# EAGLE design breadboard-long-with-header (EAGLE 7.1.0)
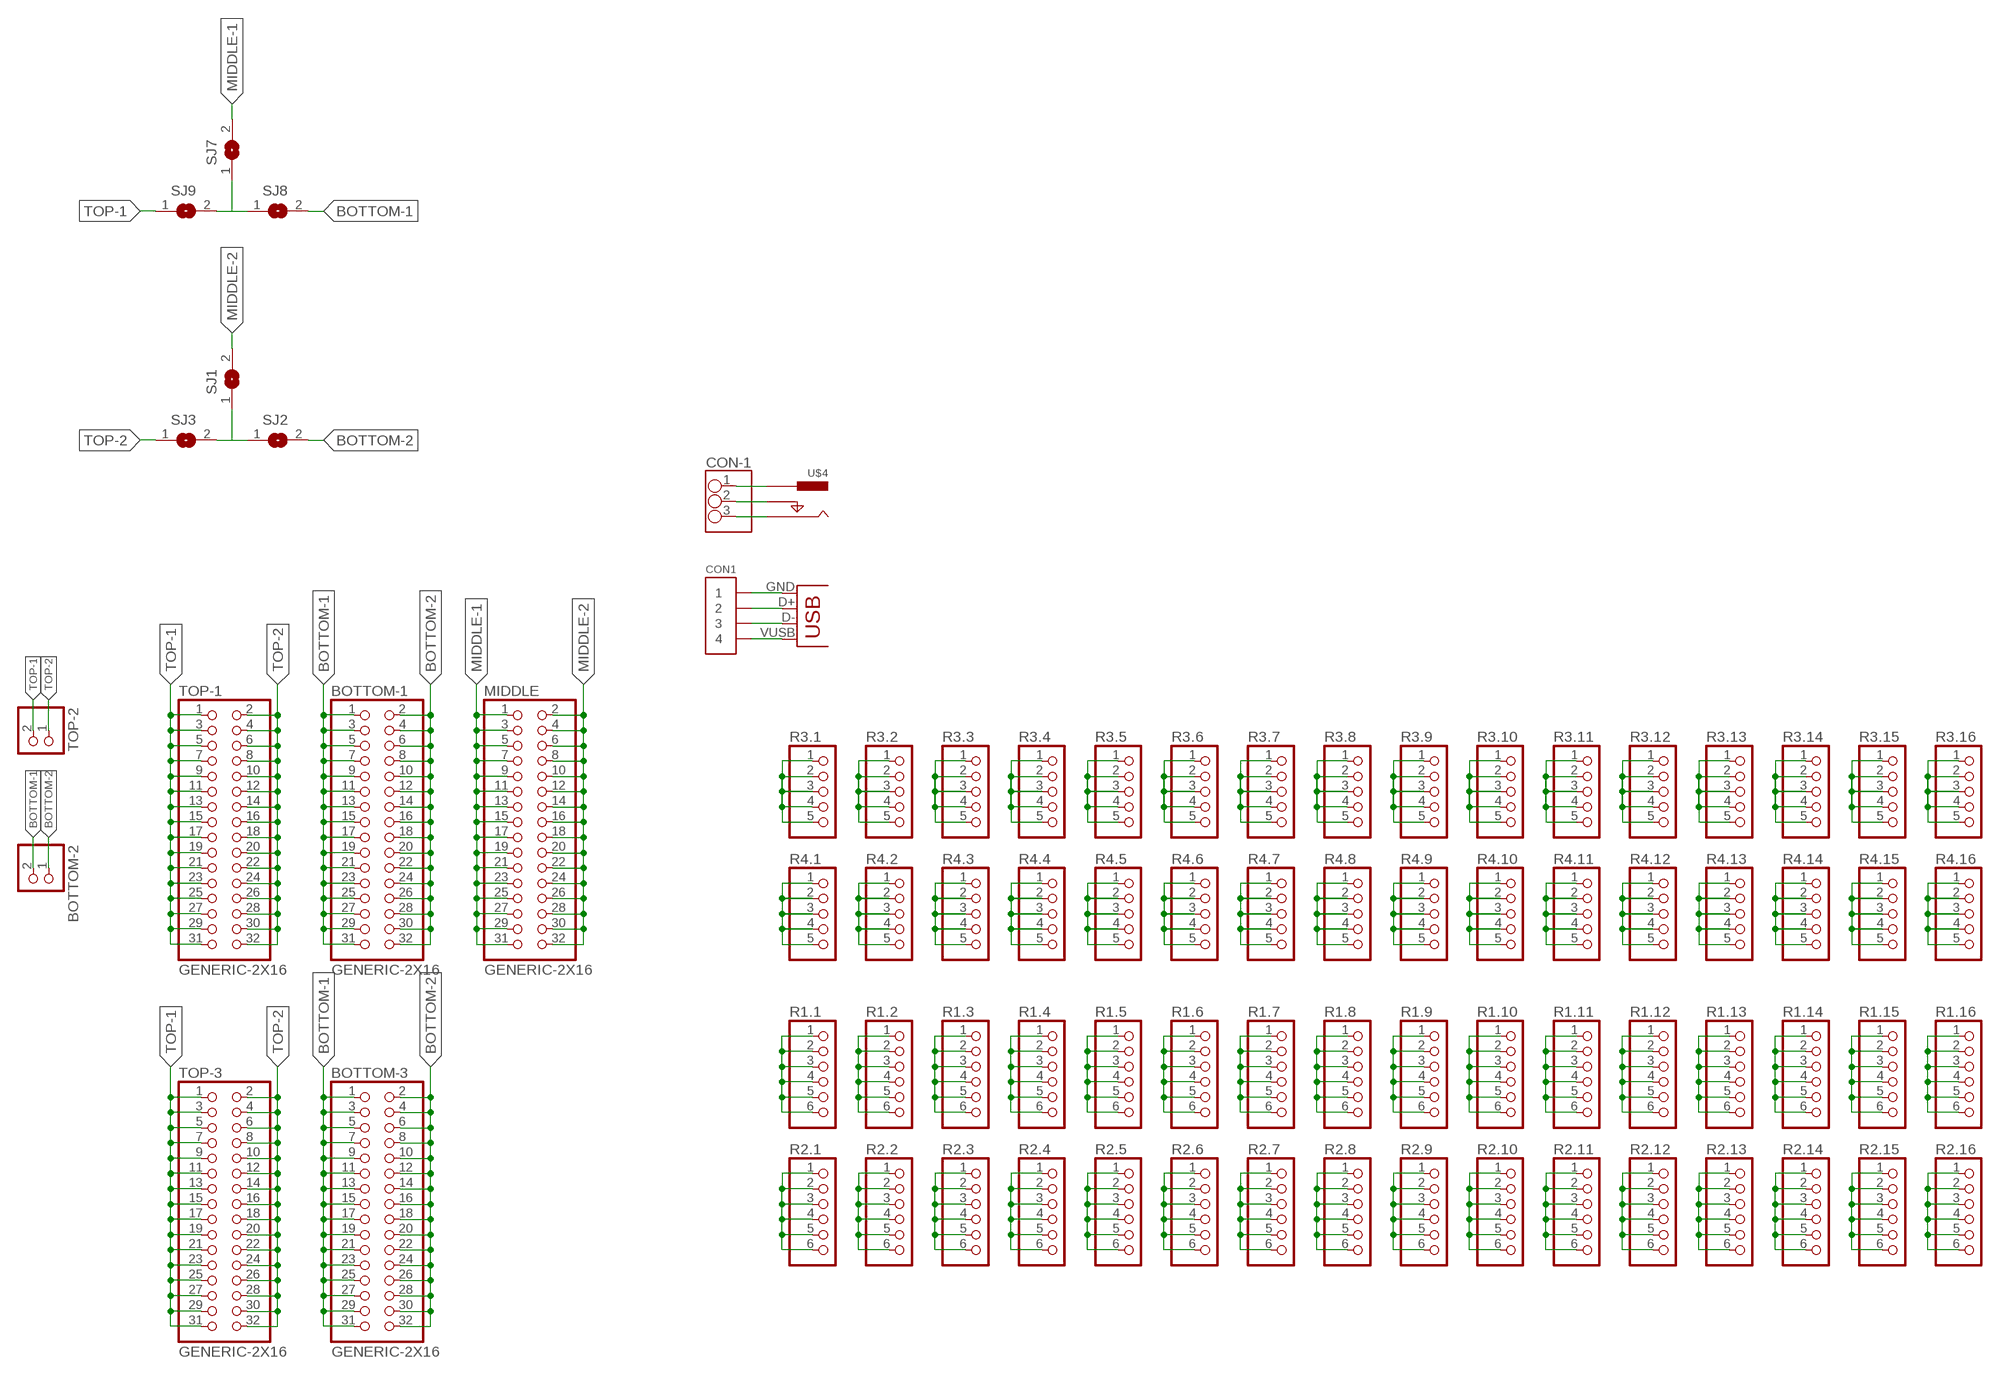
[diagram p0: schematic, sheet 1]

## Parts
BOTTOM-1  GENERIC-2X16  [PINHEADER-100MIL-2X16-NOSILK]
BOTTOM-2  GENERIC-1X2  [PINHEADER-100MIL-1X2-NOSILK]
BOTTOM-3  GENERIC-2X16  [PINHEADER-100MIL-2X16-NOSILK]
CON1  GENERIC-1X4STRAIGHT  [PINHEADER-100MIL-1X4-NOSILK]
CON-1  GENERIC-1X3  [PINHEADER-100MIL-1X3-NOSILK]
MIDDLE  GENERIC-2X16  [PINHEADER-100MIL-2X16-NOSILK]
R1.1  GENERIC-1X6  [PINHEADER-100MIL-1X6-NOSILK]
R1.2  GENERIC-1X6  [PINHEADER-100MIL-1X6-NOSILK]
R1.3  GENERIC-1X6  [PINHEADER-100MIL-1X6-NOSILK]
R1.4  GENERIC-1X6  [PINHEADER-100MIL-1X6-NOSILK]
R1.5  GENERIC-1X6  [PINHEADER-100MIL-1X6-NOSILK]
R1.6  GENERIC-1X6  [PINHEADER-100MIL-1X6-NOSILK]
R1.7  GENERIC-1X6  [PINHEADER-100MIL-1X6-NOSILK]
R1.8  GENERIC-1X6  [PINHEADER-100MIL-1X6-NOSILK]
R1.9  GENERIC-1X6  [PINHEADER-100MIL-1X6-NOSILK]
R1.10  GENERIC-1X6  [PINHEADER-100MIL-1X6-NOSILK]
R1.11  GENERIC-1X6  [PINHEADER-100MIL-1X6-NOSILK]
R1.12  GENERIC-1X6  [PINHEADER-100MIL-1X6-NOSILK]
R1.13  GENERIC-1X6  [PINHEADER-100MIL-1X6-NOSILK]
R1.14  GENERIC-1X6  [PINHEADER-100MIL-1X6-NOSILK]
R1.15  GENERIC-1X6  [PINHEADER-100MIL-1X6-NOSILK]
R1.16  GENERIC-1X6  [PINHEADER-100MIL-1X6-NOSILK]
R2.1  GENERIC-1X6  [PINHEADER-100MIL-1X6-NOSILK]
R2.2  GENERIC-1X6  [PINHEADER-100MIL-1X6-NOSILK]
R2.3  GENERIC-1X6  [PINHEADER-100MIL-1X6-NOSILK]
R2.4  GENERIC-1X6  [PINHEADER-100MIL-1X6-NOSILK]
R2.5  GENERIC-1X6  [PINHEADER-100MIL-1X6-NOSILK]
R2.6  GENERIC-1X6  [PINHEADER-100MIL-1X6-NOSILK]
R2.7  GENERIC-1X6  [PINHEADER-100MIL-1X6-NOSILK]
R2.8  GENERIC-1X6  [PINHEADER-100MIL-1X6-NOSILK]
R2.9  GENERIC-1X6  [PINHEADER-100MIL-1X6-NOSILK]
R2.10  GENERIC-1X6  [PINHEADER-100MIL-1X6-NOSILK]
R2.11  GENERIC-1X6  [PINHEADER-100MIL-1X6-NOSILK]
R2.12  GENERIC-1X6  [PINHEADER-100MIL-1X6-NOSILK]
R2.13  GENERIC-1X6  [PINHEADER-100MIL-1X6-NOSILK]
R2.14  GENERIC-1X6  [PINHEADER-100MIL-1X6-NOSILK]
R2.15  GENERIC-1X6  [PINHEADER-100MIL-1X6-NOSILK]
R2.16  GENERIC-1X6  [PINHEADER-100MIL-1X6-NOSILK]
R3.1  GENERIC-1X5  [PINHEADER-100MIL-1X5-NOSILK]
R3.2  GENERIC-1X5  [PINHEADER-100MIL-1X5-NOSILK]
R3.3  GENERIC-1X5  [PINHEADER-100MIL-1X5-NOSILK]
R3.4  GENERIC-1X5  [PINHEADER-100MIL-1X5-NOSILK]
R3.5  GENERIC-1X5  [PINHEADER-100MIL-1X5-NOSILK]
R3.6  GENERIC-1X5  [PINHEADER-100MIL-1X5-NOSILK]
R3.7  GENERIC-1X5  [PINHEADER-100MIL-1X5-NOSILK]
R3.8  GENERIC-1X5  [PINHEADER-100MIL-1X5-NOSILK]
R3.9  GENERIC-1X5  [PINHEADER-100MIL-1X5-NOSILK]
R3.10  GENERIC-1X5  [PINHEADER-100MIL-1X5-NOSILK]
R3.11  GENERIC-1X5  [PINHEADER-100MIL-1X5-NOSILK]
R3.12  GENERIC-1X5  [PINHEADER-100MIL-1X5-NOSILK]
R3.13  GENERIC-1X5  [PINHEADER-100MIL-1X5-NOSILK]
R3.14  GENERIC-1X5  [PINHEADER-100MIL-1X5-NOSILK]
R3.15  GENERIC-1X5  [PINHEADER-100MIL-1X5-NOSILK]
R3.16  GENERIC-1X5  [PINHEADER-100MIL-1X5-NOSILK]
R4.1  GENERIC-1X5  [PINHEADER-100MIL-1X5-NOSILK]
R4.2  GENERIC-1X5  [PINHEADER-100MIL-1X5-NOSILK]
R4.3  GENERIC-1X5  [PINHEADER-100MIL-1X5-NOSILK]
R4.4  GENERIC-1X5  [PINHEADER-100MIL-1X5-NOSILK]
R4.5  GENERIC-1X5  [PINHEADER-100MIL-1X5-NOSILK]
R4.6  GENERIC-1X5  [PINHEADER-100MIL-1X5-NOSILK]
R4.7  GENERIC-1X5  [PINHEADER-100MIL-1X5-NOSILK]
R4.8  GENERIC-1X5  [PINHEADER-100MIL-1X5-NOSILK]
R4.9  GENERIC-1X5  [PINHEADER-100MIL-1X5-NOSILK]
R4.10  GENERIC-1X5  [PINHEADER-100MIL-1X5-NOSILK]
R4.11  GENERIC-1X5  [PINHEADER-100MIL-1X5-NOSILK]
R4.12  GENERIC-1X5  [PINHEADER-100MIL-1X5-NOSILK]
R4.13  GENERIC-1X5  [PINHEADER-100MIL-1X5-NOSILK]
R4.14  GENERIC-1X5  [PINHEADER-100MIL-1X5-NOSILK]
R4.15  GENERIC-1X5  [PINHEADER-100MIL-1X5-NOSILK]
R4.16  GENERIC-1X5  [PINHEADER-100MIL-1X5-NOSILK]
SJ1  SJ  [SJ]
SJ2  SJ  [SJ]
SJ3  SJ  [SJ]
SJ7  SJ  [SJ]
SJ8  SJ  [SJ]
SJ9  SJ  [SJ]
TOP-1  GENERIC-2X16  [PINHEADER-100MIL-2X16-NOSILK]
TOP-2  GENERIC-1X2  [PINHEADER-100MIL-1X2-NOSILK]
TOP-3  GENERIC-2X16  [PINHEADER-100MIL-2X16-NOSILK]
U$3  USBMINI-HAND  [USB-MINI-B-HAND_EXTRA_LONG]
U$4  POWER-BARREL_JACKEBAY  [POWER-BARREL-2MM1-EBAY]

## Nets
BOTTOM-1: BOTTOM-1.1 BOTTOM-1.3 BOTTOM-1.5 BOTTOM-1.7 BOTTOM-1.9 BOTTOM-1.11 BOTTOM-1.13 BOTTOM-1.15 BOTTOM-1.17 BOTTOM-1.19 BOTTOM-1.21 BOTTOM-1.23 BOTTOM-1.25 BOTTOM-1.27 BOTTOM-1.29 BOTTOM-1.31 BOTTOM-2.2 BOTTOM-3.1 BOTTOM-3.3 BOTTOM-3.5 BOTTOM-3.7 BOTTOM-3.9 BOTTOM-3.11 BOTTOM-3.13 BOTTOM-3.15 BOTTOM-3.17 BOTTOM-3.19 BOTTOM-3.21 BOTTOM-3.23 BOTTOM-3.25 BOTTOM-3.27 BOTTOM-3.29 BOTTOM-3.31 SJ8.2
BOTTOM-2: BOTTOM-1.2 BOTTOM-1.4 BOTTOM-1.6 BOTTOM-1.8 BOTTOM-1.10 BOTTOM-1.12 BOTTOM-1.14 BOTTOM-1.16 BOTTOM-1.18 BOTTOM-1.20 BOTTOM-1.22 BOTTOM-1.24 BOTTOM-1.26 BOTTOM-1.28 BOTTOM-1.30 BOTTOM-1.32 BOTTOM-2.1 BOTTOM-3.2 BOTTOM-3.4 BOTTOM-3.6 BOTTOM-3.8 BOTTOM-3.10 BOTTOM-3.12 BOTTOM-3.14 BOTTOM-3.16 BOTTOM-3.18 BOTTOM-3.20 BOTTOM-3.22 BOTTOM-3.24 BOTTOM-3.26 BOTTOM-3.28 BOTTOM-3.30 BOTTOM-3.32 SJ2.2
CENTER: CON-1.1 U$4.P$4(CENTER)
MIDDLE-1: MIDDLE.1 MIDDLE.3 MIDDLE.5 MIDDLE.7 MIDDLE.9 MIDDLE.11 MIDDLE.13 MIDDLE.15 MIDDLE.17 MIDDLE.19 MIDDLE.21 MIDDLE.23 MIDDLE.25 MIDDLE.27 MIDDLE.29 MIDDLE.31 SJ7.2
MIDDLE-2: MIDDLE.2 MIDDLE.4 MIDDLE.6 MIDDLE.8 MIDDLE.10 MIDDLE.12 MIDDLE.14 MIDDLE.16 MIDDLE.18 MIDDLE.20 MIDDLE.22 MIDDLE.24 MIDDLE.26 MIDDLE.28 MIDDLE.30 MIDDLE.32 SJ1.2
N$1: R3.1.1 R3.1.2 R3.1.3 R3.1.4 R3.1.5
N$2: R4.1.1 R4.1.2 R4.1.3 R4.1.4 R4.1.5
N$3: R2.6.1 R2.6.2 R2.6.3 R2.6.4 R2.6.5 R2.6.6
N$4: R1.6.1 R1.6.2 R1.6.3 R1.6.4 R1.6.5 R1.6.6
N$5: R2.7.1 R2.7.2 R2.7.3 R2.7.4 R2.7.5 R2.7.6
N$6: R1.7.1 R1.7.2 R1.7.3 R1.7.4 R1.7.5 R1.7.6
N$7: R2.8.1 R2.8.2 R2.8.3 R2.8.4 R2.8.5 R2.8.6
N$8: R1.8.1 R1.8.2 R1.8.3 R1.8.4 R1.8.5 R1.8.6
N$9: R2.9.1 R2.9.2 R2.9.3 R2.9.4 R2.9.5 R2.9.6
N$10: R2.1.1 R2.1.2 R2.1.3 R2.1.4 R2.1.5 R2.1.6
N$11: R1.1.1 R1.1.2 R1.1.3 R1.1.4 R1.1.5 R1.1.6
N$12: R2.3.1 R2.3.2 R2.3.3 R2.3.4 R2.3.5 R2.3.6
N$13: R2.2.1 R2.2.2 R2.2.3 R2.2.4 R2.2.5 R2.2.6
N$14: R1.2.1 R1.2.2 R1.2.3 R1.2.4 R1.2.5 R1.2.6
N$15: R1.3.1 R1.3.2 R1.3.3 R1.3.4 R1.3.5 R1.3.6
N$16: R2.4.1 R2.4.2 R2.4.3 R2.4.4 R2.4.5 R2.4.6
N$17: R1.4.1 R1.4.2 R1.4.3 R1.4.4 R1.4.5 R1.4.6
N$18: R2.5.1 R2.5.2 R2.5.3 R2.5.4 R2.5.5 R2.5.6
N$19: R1.5.1 R1.5.2 R1.5.3 R1.5.4 R1.5.5 R1.5.6
N$20: R3.2.1 R3.2.2 R3.2.3 R3.2.4 R3.2.5
N$21: R4.2.1 R4.2.2 R4.2.3 R4.2.4 R4.2.5
N$22: R3.3.1 R3.3.2 R3.3.3 R3.3.4 R3.3.5
N$23: R4.3.1 R4.3.2 R4.3.3 R4.3.4 R4.3.5
N$24: R3.4.1 R3.4.2 R3.4.3 R3.4.4 R3.4.5
N$25: R4.4.1 R4.4.2 R4.4.3 R4.4.4 R4.4.5
N$26: R3.5.1 R3.5.2 R3.5.3 R3.5.4 R3.5.5
N$27: R4.5.1 R4.5.2 R4.5.3 R4.5.4 R4.5.5
N$28: R3.6.1 R3.6.2 R3.6.3 R3.6.4 R3.6.5
N$29: R4.6.1 R4.6.2 R4.6.3 R4.6.4 R4.6.5
N$30: R3.7.1 R3.7.2 R3.7.3 R3.7.4 R3.7.5
N$31: R4.7.1 R4.7.2 R4.7.3 R4.7.4 R4.7.5
N$32: R3.8.1 R3.8.2 R3.8.3 R3.8.4 R3.8.5
N$33: R4.8.1 R4.8.2 R4.8.3 R4.8.4 R4.8.5
N$34: R3.9.1 R3.9.2 R3.9.3 R3.9.4 R3.9.5
N$35: R4.9.1 R4.9.2 R4.9.3 R4.9.4 R4.9.5
N$36: SJ1.1 SJ2.1 SJ3.2
N$37: R1.9.1 R1.9.2 R1.9.3 R1.9.4 R1.9.5 R1.9.6
N$38: SJ7.1 SJ8.1 SJ9.2
N$39: R2.10.1 R2.10.2 R2.10.3 R2.10.4 R2.10.5 R2.10.6
N$40: R1.10.1 R1.10.2 R1.10.3 R1.10.4 R1.10.5 R1.10.6
N$41: R2.11.1 R2.11.2 R2.11.3 R2.11.4 R2.11.5 R2.11.6
N$42: R1.11.1 R1.11.2 R1.11.3 R1.11.4 R1.11.5 R1.11.6
N$43: R2.12.1 R2.12.2 R2.12.3 R2.12.4 R2.12.5 R2.12.6
N$44: R1.12.1 R1.12.2 R1.12.3 R1.12.4 R1.12.5 R1.12.6
N$45: R2.13.1 R2.13.2 R2.13.3 R2.13.4 R2.13.5 R2.13.6
N$46: R1.13.1 R1.13.2 R1.13.3 R1.13.4 R1.13.5 R1.13.6
N$47: R2.14.1 R2.14.2 R2.14.3 R2.14.4 R2.14.5 R2.14.6
N$48: R1.14.1 R1.14.2 R1.14.3 R1.14.4 R1.14.5 R1.14.6
N$49: R2.15.1 R2.15.2 R2.15.3 R2.15.4 R2.15.5 R2.15.6
N$50: R1.15.1 R1.15.2 R1.15.3 R1.15.4 R1.15.5 R1.15.6
N$51: R2.16.1 R2.16.2 R2.16.3 R2.16.4 R2.16.5 R2.16.6
N$52: R1.16.1 R1.16.2 R1.16.3 R1.16.4 R1.16.5 R1.16.6
N$53: R3.10.1 R3.10.2 R3.10.3 R3.10.4 R3.10.5
N$54: R4.10.1 R4.10.2 R4.10.3 R4.10.4 R4.10.5
N$55: R3.11.1 R3.11.2 R3.11.3 R3.11.4 R3.11.5
N$56: R4.11.1 R4.11.2 R4.11.3 R4.11.4 R4.11.5
N$57: R3.12.1 R3.12.2 R3.12.3 R3.12.4 R3.12.5
N$58: R4.12.1 R4.12.2 R4.12.3 R4.12.4 R4.12.5
N$59: R3.13.1 R3.13.2 R3.13.3 R3.13.4 R3.13.5
N$60: R4.13.1 R4.13.2 R4.13.3 R4.13.4 R4.13.5
N$61: R3.14.1 R3.14.2 R3.14.3 R3.14.4 R3.14.5
N$62: R4.14.1 R4.14.2 R4.14.3 R4.14.4 R4.14.5
N$63: R3.15.1 R3.15.2 R3.15.3 R3.15.4 R3.15.5
N$64: R4.15.1 R4.15.2 R4.15.3 R4.15.4 R4.15.5
N$65: R3.16.1 R3.16.2 R3.16.3 R3.16.4 R3.16.5
N$66: R4.16.1 R4.16.2 R4.16.3 R4.16.4 R4.16.5
SLEEVE: CON-1.3 U$4.P$3(OUTER)
SWITCH: CON-1.2 U$4.P$2(SWITCH)
TOP-1: SJ9.1 TOP-1.1 TOP-1.3 TOP-1.5 TOP-1.7 TOP-1.9 TOP-1.11 TOP-1.13 TOP-1.15 TOP-1.17 TOP-1.19 TOP-1.21 TOP-1.23 TOP-1.25 TOP-1.27 TOP-1.29 TOP-1.31 TOP-2.2 TOP-3.1 TOP-3.3 TOP-3.5 TOP-3.7 TOP-3.9 TOP-3.11 TOP-3.13 TOP-3.15 TOP-3.17 TOP-3.19 TOP-3.21 TOP-3.23 TOP-3.25 TOP-3.27 TOP-3.29 TOP-3.31
TOP-2: SJ3.1 TOP-1.2 TOP-1.4 TOP-1.6 TOP-1.8 TOP-1.10 TOP-1.12 TOP-1.14 TOP-1.16 TOP-1.18 TOP-1.20 TOP-1.22 TOP-1.24 TOP-1.26 TOP-1.28 TOP-1.30 TOP-1.32 TOP-2.1 TOP-3.2 TOP-3.4 TOP-3.6 TOP-3.8 TOP-3.10 TOP-3.12 TOP-3.14 TOP-3.16 TOP-3.18 TOP-3.20 TOP-3.22 TOP-3.24 TOP-3.26 TOP-3.28 TOP-3.30 TOP-3.32
USB-D+: CON1.2 U$3.D+
USB-DI: CON1.3 U$3.D-
USB-GND: CON1.1 U$3.GND
USB-V+: CON1.4 U$3.VUSB(VBUS)

## Library data of the parts
BOTTOM-1 BOTTOM-3 MIDDLE TOP-1 TOP-3 = p.peter-connectors:GENERIC-2X16
BOTTOM-2 TOP-2 = p.peter-connectors:GENERIC-1X2
CON1 = p.peter-connectors:GENERIC-1X4
CON-1 = p.peter-connectors:GENERIC-1X3
R1.1-R1.16 R2.1-R2.16 = p.peter-connectors:GENERIC-1X6
R3.1-R3.16 R4.1-R4.16 = p.peter-connectors:GENERIC-1X5
SJ1-SJ3 SJ7-SJ9 = jumper:SJ: SMD solder JUMPER
U$3 = p.peter-connectors:USB
U$4 = p.peter-connectors:POWER-BARREL_JACK

## Board
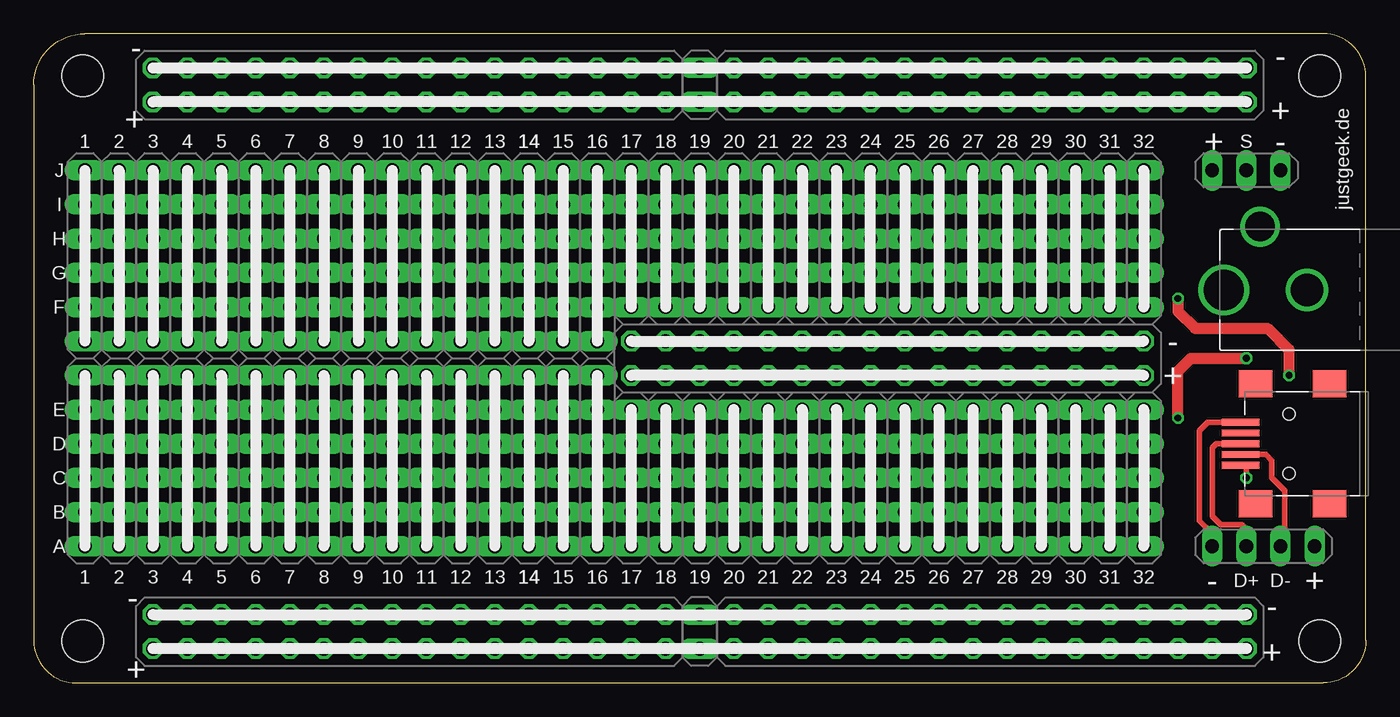
[diagram p1: board, top side]
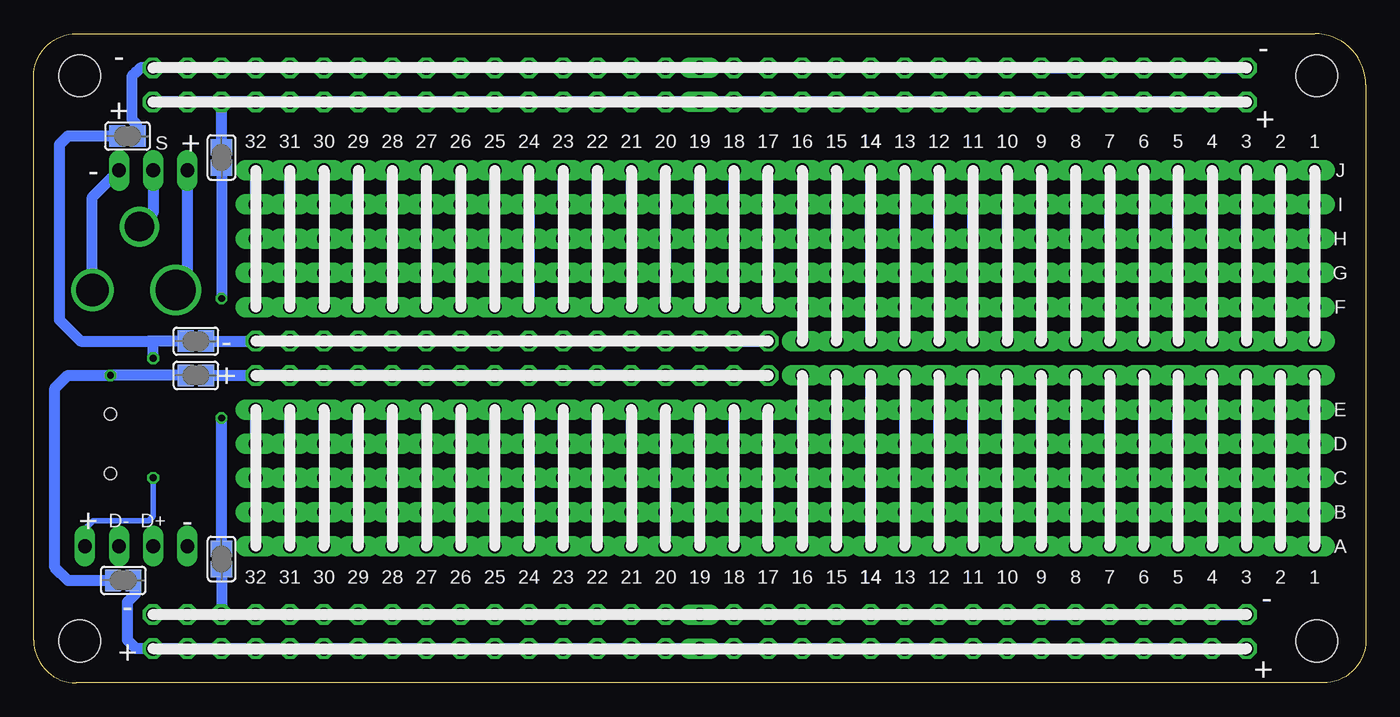
[diagram p2: board, bottom side, seen from below]

Size 99.06 x 48.26 mm. Coordinates in mm from the lower left corner, seen from the top.
Outline: 3.17,0 95.89,0 arc90 99.06,3.17 99.06,45.09 arc90 95.89,48.26 91.44,48.26 7.62,48.26 3.81,48.26 arc90 0,44.45 0,3.17 arc90 3.17,0
Copper layers (1*16): Top 0.0356mm / dielectric 1.5011mm / Bottom 0.0356mm
Design rules "breadboard": minimum track width 6mil, minimum drill 13mil, track to track 6mil, track to pad 6mil, pad to pad 6mil, via to via 6mil, smd to smd 6mil, copper to edge 15mil, drill to drill 6mil, minimum pad ring 8mil, minimum via ring 7mil, stop-mask expansion 4mil, vias tented up to drill 4.1mm, thermal gap 10mil
Holes 3.1 mm at 95.64,45.12 95.64,3.12 3.63,3.12 3.63,45.12

### Footprints (pad centres in the part's own frame; a part is rotated, then mirrored left to right if it is on the bottom)
PINHEADER-100MIL-2X16-NOSILK = drill 1.016 octagon: 1 -19.05,-1.27; 2 -19.05,1.27; 3 -16.51,-1.27; 4 -16.51,1.27; 5 -13.97,-1.27; 6 -13.97,1.27; 7 -11.43,-1.27; 8 -11.43,1.27; 9 -8.89,-1.27; 10 -8.89,1.27; 11 -6.35,-1.27; 12 -6.35,1.27; 13 -3.81,-1.27; 14 -3.81,1.27; 15 -1.27,-1.27; 16 -1.27,1.27; 17 1.27,-1.27; 18 1.27,1.27; 19 3.81,-1.27; 20 3.81,1.27; 21 6.35,-1.27; 22 6.35,1.27; 23 8.89,-1.27; 24 8.89,1.27; 25 11.43,-1.27; 26 11.43,1.27; 27 13.97,-1.27; 28 13.97,1.27; 29 16.51,-1.27; 30 16.51,1.27; 31 19.05,-1.27; 32 19.05,1.27
PINHEADER-100MIL-1X2-NOSILK = drill 1.016 long: 1 -1.27,0; 2 1.27,0
PINHEADER-100MIL-1X4-NOSILK = drill 1.016 long: 1 -3.81,0; 2 -1.27,0; 3 1.27,0; 4 3.81,0
PINHEADER-100MIL-1X3-NOSILK = drill 1.016 long: 1 -2.54,0; 2 0,0; 3 2.54,0
PINHEADER-100MIL-1X6-NOSILK = drill 1.016 long: 1 -6.35,0; 2 -3.81,0; 3 -1.27,0; 4 1.27,0; 5 3.81,0; 6 6.35,0
PINHEADER-100MIL-1X5-NOSILK = drill 1.016 long: 1 -5.08,0; 2 -2.54,0; 3 0,0; 4 2.54,0; 5 5.08,0
SJ = smd 1.168 x 1.6: 1 -0.762,0; 2 0.762,0
USB-MINI-B-HAND_EXTRA_LONG = smd 2 x 2.5: BODY@1 -4.45,2.5; BODY@2 4.45,2.5; BODY@3 4.45,-3; BODY@4 -4.45,-3 | smd 0.5 x 2.8: D+ 0,3.6; D- -0.8,3.6; GND 1.6,3.6; ID 0.8,3.6; VUSB -1.6,3.6 | hole 0.9: -2.2,0; 2.2,0
POWER-BARREL-2MM1-EBAY = drill 2.2: P$2 0.5,-4.7 | drill 2.4: P$3 -3,0 | drill 3: P$4 3.2,0

### Placement (x,y rotation side)
BOTTOM-1  27.94,3.81 0 top
BOTTOM-2  49.53,3.81 270 top
BOTTOM-3  71.12,3.81 0 top
CON1  91.44,10.16 0 top
CON-1  90.17,38.1 0 top
MIDDLE  63.5,24.13 0 top
R1.1  3.81,31.75 90 top
R1.2  6.35,31.75 90 top
R1.3  8.89,31.75 90 top
R1.4  11.43,31.75 90 top
R1.5  13.97,31.75 90 top
R1.6  16.51,31.75 90 top
R1.7  19.05,31.75 90 top
R1.8  21.59,31.75 90 top
R1.9  24.13,31.75 90 top
R1.10  26.67,31.75 90 top
R1.11  29.21,31.75 90 top
R1.12  31.75,31.75 90 top
R1.13  34.29,31.75 90 top
R1.14  36.83,31.75 90 top
R1.15  39.37,31.75 90 top
R1.16  41.91,31.75 90 top
R2.1  3.81,16.51 90 top
R2.2  6.35,16.51 90 top
R2.3  8.89,16.51 90 top
R2.4  11.43,16.51 90 top
R2.5  13.97,16.51 90 top
R2.6  16.51,16.51 90 top
R2.7  19.05,16.51 90 top
R2.8  21.59,16.51 90 top
R2.9  24.13,16.51 90 top
R2.10  26.67,16.51 90 top
R2.11  29.21,16.51 90 top
R2.12  31.75,16.51 90 top
R2.13  34.29,16.51 90 top
R2.14  36.83,16.51 90 top
R2.15  39.37,16.51 90 top
R2.16  41.91,16.51 90 top
R3.1  44.45,33.02 90 top
R3.2  46.99,33.02 90 top
R3.3  49.53,33.02 90 top
R3.4  52.07,33.02 90 top
R3.5  54.61,33.02 90 top
R3.6  57.15,33.02 90 top
R3.7  59.69,33.02 90 top
R3.8  62.23,33.02 90 top
R3.9  64.77,33.02 90 top
R3.10  67.31,33.02 90 top
R3.11  69.85,33.02 90 top
R3.12  72.39,33.02 90 top
R3.13  74.93,33.02 90 top
R3.14  77.47,33.02 90 top
R3.15  80.01,33.02 90 top
R3.16  82.55,33.02 90 top
R4.1  44.45,15.24 90 top
R4.2  46.99,15.24 90 top
R4.3  49.53,15.24 90 top
R4.4  52.07,15.24 90 top
R4.5  54.61,15.24 90 top
R4.6  57.15,15.24 90 top
R4.7  59.69,15.24 90 top
R4.8  62.23,15.24 90 top
R4.9  64.77,15.24 90 top
R4.10  67.31,15.24 90 top
R4.11  69.85,15.24 90 top
R4.12  72.39,15.24 90 top
R4.13  74.93,15.24 90 top
R4.14  77.47,15.24 90 top
R4.15  80.01,15.24 90 top
R4.16  82.55,15.24 90 top
SJ1  87,25.4 0 bottom
SJ2  85.09,9.21 270 bottom
SJ3  92.08,40.64 180 bottom
SJ7  87,22.86 0 bottom
SJ8  92.39,7.62 0 bottom
SJ9  85.09,39.05 270 bottom
TOP-1  27.94,44.45 0 top
TOP-2  49.53,44.45 270 top
TOP-3  71.12,44.45 0 top
U$3  93.34,17.78 90 top
U$4  91.69,29.21 180 top

### Tracks (layer width: path | path; a pad name or v marks a point on that pad's centre or on a via)
BOTTOM-1
  Bottom 0.813: BOTTOM-1.1 BOTTOM-1.3 BOTTOM-1.5 BOTTOM-1.7 BOTTOM-1.9 BOTTOM-1.11 BOTTOM-1.13 BOTTOM-1.15 BOTTOM-1.17 BOTTOM-1.19 BOTTOM-1.21 BOTTOM-1.23 BOTTOM-1.25 BOTTOM-1.27 BOTTOM-1.29 BOTTOM-1.31 BOTTOM-2.2 BOTTOM-3.1 BOTTOM-3.3 BOTTOM-3.5 BOTTOM-3.7 BOTTOM-3.9 BOTTOM-3.11 BOTTOM-3.13 BOTTOM-3.15 BOTTOM-3.17 BOTTOM-3.19 BOTTOM-3.21 BOTTOM-3.23 BOTTOM-3.25 BOTTOM-3.27 BOTTOM-3.29 BOTTOM-3.31 91.44,2.54 92.08,3.17 92.08,6.03 91.44,6.67 91.44,7.43 SJ8.2
BOTTOM-2
  Bottom 0.813: BOTTOM-1.2 BOTTOM-1.4 BOTTOM-1.6 BOTTOM-1.8 BOTTOM-1.10 BOTTOM-1.12 BOTTOM-1.14 BOTTOM-1.16 BOTTOM-1.18 BOTTOM-1.20 BOTTOM-1.22 BOTTOM-1.24 BOTTOM-1.26 BOTTOM-1.28 BOTTOM-1.30 BOTTOM-1.32 BOTTOM-2.1 BOTTOM-3.2 BOTTOM-3.4 BOTTOM-3.6 BOTTOM-3.8 BOTTOM-3.10 BOTTOM-3.12 BOTTOM-3.14 BOTTOM-3.16 BOTTOM-3.18 BOTTOM-3.20 BOTTOM-3.22 BOTTOM-3.24 BOTTOM-3.26 BOTTOM-3.28 | SJ2.2 BOTTOM-3.28 | BOTTOM-3.28 BOTTOM-3.30 BOTTOM-3.32
CENTER
  Bottom 0.813: CON-1.1 87.63,30.07 U$4.P$4
MIDDLE-1
  Bottom 0.813: SJ7.2 MIDDLE.31 MIDDLE.29 MIDDLE.27 MIDDLE.25 MIDDLE.23 MIDDLE.21 MIDDLE.19 MIDDLE.17 MIDDLE.15 MIDDLE.13 MIDDLE.11 MIDDLE.9 MIDDLE.7 MIDDLE.5 MIDDLE.3 MIDDLE.1
MIDDLE-2
  Bottom 0.813: SJ1.2 MIDDLE.32 MIDDLE.30 MIDDLE.28 MIDDLE.26 MIDDLE.24 MIDDLE.22 MIDDLE.20 MIDDLE.18 MIDDLE.16 MIDDLE.14 MIDDLE.12 MIDDLE.10 MIDDLE.8 MIDDLE.6 MIDDLE.4 MIDDLE.2
N$1
  Bottom 0.813: R3.1.1 R3.1.2 R3.1.3 R3.1.4 R3.1.5
N$2
  Bottom 0.813: R4.1.1 R4.1.2 R4.1.3 R4.1.4 R4.1.5
N$3
  Bottom 0.813: R2.6.6 R2.6.5 R2.6.4 R2.6.3 R2.6.2 R2.6.1
N$4
  Bottom 0.813: R1.6.6 R1.6.5 R1.6.4 R1.6.3 R1.6.2 R1.6.1
N$5
  Bottom 0.813: R2.7.6 R2.7.5 R2.7.4 R2.7.3 R2.7.2 R2.7.1
N$6
  Bottom 0.813: R1.7.6 R1.7.5 R1.7.4 R1.7.3 R1.7.2 R1.7.1
N$7
  Bottom 0.813: R2.8.6 R2.8.5 R2.8.4 R2.8.3 R2.8.2 R2.8.1
N$8
  Bottom 0.813: R1.8.6 R1.8.5 R1.8.4 R1.8.3 R1.8.2 R1.8.1
N$9
  Bottom 0.813: R2.9.6 R2.9.5 R2.9.4 R2.9.3 R2.9.2 R2.9.1
N$10
  Bottom 0.813: R2.1.6 R2.1.5 R2.1.4 R2.1.3 R2.1.2 R2.1.1
N$11
  Bottom 0.813: R1.1.6 R1.1.5 R1.1.4 R1.1.3 R1.1.2 R1.1.1
N$12
  Bottom 0.813: R2.3.6 R2.3.5 R2.3.4 R2.3.3 R2.3.2 R2.3.1
N$13
  Bottom 0.813: R2.2.6 R2.2.5 R2.2.4 R2.2.3 R2.2.2 R2.2.1
N$14
  Bottom 0.813: R1.2.6 R1.2.5 R1.2.4 R1.2.3 R1.2.2 R1.2.1
N$15
  Bottom 0.813: R1.3.6 R1.3.5 R1.3.4 R1.3.3 R1.3.2 R1.3.1
N$16
  Bottom 0.813: R2.4.6 R2.4.5 R2.4.4 R2.4.3 R2.4.2 R2.4.1
N$17
  Bottom 0.813: R1.4.6 R1.4.5 R1.4.4 R1.4.3 R1.4.2 R1.4.1
N$18
  Bottom 0.813: R2.5.6 R2.5.5 R2.5.4 R2.5.3 R2.5.2 R2.5.1
N$19
  Bottom 0.813: R1.5.6 R1.5.5 R1.5.4 R1.5.3 R1.5.2 R1.5.1
N$20
  Bottom 0.813: R3.2.1 R3.2.2 R3.2.3 R3.2.4 R3.2.5
N$21
  Bottom 0.813: R4.2.1 R4.2.2 R4.2.3 R4.2.4 R4.2.5
N$22
  Bottom 0.813: R3.3.1 R3.3.2 R3.3.3 R3.3.4 R3.3.5
N$23
  Bottom 0.813: R4.3.1 R4.3.2 R4.3.3 R4.3.4 R4.3.5
N$24
  Bottom 0.813: R3.4.1 R3.4.2 R3.4.3 R3.4.4 R3.4.5
N$25
  Bottom 0.813: R4.4.1 R4.4.2 R4.4.3 R4.4.4 R4.4.5
N$26
  Bottom 0.813: R3.5.1 R3.5.2 R3.5.3 R3.5.4 R3.5.5
N$27
  Bottom 0.813: R4.5.1 R4.5.2 R4.5.3 R4.5.4 R4.5.5
N$28
  Bottom 0.813: R3.6.1 R3.6.2 R3.6.3 R3.6.4 R3.6.5
N$29
  Bottom 0.813: R4.6.1 R4.6.2 R4.6.3 R4.6.4 R4.6.5
N$30
  Bottom 0.813: R3.7.1 R3.7.2 R3.7.3 R3.7.4 R3.7.5
N$31
  Bottom 0.813: R4.7.1 R4.7.2 R4.7.3 R4.7.4 R4.7.5
N$32
  Bottom 0.813: R3.8.1 R3.8.2 R3.8.3 R3.8.4 R3.8.5
N$33
  Bottom 0.813: R4.8.1 R4.8.2 R4.8.3 R4.8.4 R4.8.5
N$34
  Bottom 0.813: R3.9.1 R3.9.2 R3.9.3 R3.9.4 R3.9.5
N$35
  Bottom 0.813: R4.9.1 R4.9.2 R4.9.3 R4.9.4 R4.9.5
N$36  (via drill 0.51)
  Top 0.813: v85.09,19.68 85.09,23.18 86.04,24.13 v90.17,24.13
  Bottom 0.813: SJ3.2 96.52,40.64 97.16,40.01 97.16,26.99 95.57,25.4 90.49,25.4 | 90.49,25.4 90.17,25.4 v90.17,24.13 | SJ2.1 v85.09,19.68 | SJ1.1 90.49,25.4
N$37
  Bottom 0.813: R1.9.6 R1.9.5 R1.9.4 R1.9.3 R1.9.2 R1.9.1
N$38  (via drill 0.51)
  Top 0.813: v85.09,28.57 85.09,27.62 86.36,26.35 91.76,26.35 93.34,24.76 v93.34,22.86
  Bottom 0.813: SJ9.2 v85.09,28.57 | SJ8.1 96.52,7.62 97.47,8.57 97.47,21.91 96.52,22.86 v93.34,22.86 SJ7.1
N$39
  Bottom 0.813: R2.10.6 R2.10.5 R2.10.4 R2.10.3 R2.10.2 R2.10.1
N$40
  Bottom 0.813: R1.10.6 R1.10.5 R1.10.4 R1.10.3 R1.10.2 R1.10.1
N$41
  Bottom 0.813: R2.11.6 R2.11.5 R2.11.4 R2.11.3 R2.11.2 R2.11.1
N$42
  Bottom 0.813: R1.11.6 R1.11.5 R1.11.4 R1.11.3 R1.11.2 R1.11.1
N$43
  Bottom 0.813: R2.12.6 R2.12.5 R2.12.4 R2.12.3 R2.12.2 R2.12.1
N$44
  Bottom 0.813: R1.12.6 R1.12.5 R1.12.4 R1.12.3 R1.12.2 R1.12.1
N$45
  Bottom 0.813: R2.13.6 R2.13.5 R2.13.4 R2.13.3 R2.13.2 R2.13.1
N$46
  Bottom 0.813: R1.13.6 R1.13.5 R1.13.4 R1.13.3 R1.13.2 R1.13.1
N$47
  Bottom 0.813: R2.14.6 R2.14.5 R2.14.4 R2.14.3 R2.14.2 R2.14.1
N$48
  Bottom 0.813: R1.14.6 R1.14.5 R1.14.4 R1.14.3 R1.14.2 R1.14.1
N$49
  Bottom 0.813: R2.15.6 R2.15.5 R2.15.4 R2.15.3 R2.15.2 R2.15.1
N$50
  Bottom 0.813: R1.15.6 R1.15.5 R1.15.4 R1.15.3 R1.15.2 R1.15.1
N$51
  Bottom 0.813: R2.16.6 R2.16.5 R2.16.4 R2.16.3 R2.16.2 R2.16.1
N$52
  Bottom 0.813: R1.16.6 R1.16.5 R1.16.4 R1.16.3 R1.16.2 R1.16.1
N$53
  Bottom 0.813: R3.10.1 R3.10.2 R3.10.3 R3.10.4 R3.10.5
N$54
  Bottom 0.813: R4.10.1 R4.10.2 R4.10.3 R4.10.4 R4.10.5
N$55
  Bottom 0.813: R3.11.1 R3.11.2 R3.11.3 R3.11.4 R3.11.5
N$56
  Bottom 0.813: R4.11.1 R4.11.2 R4.11.3 R4.11.4 R4.11.5
N$57
  Bottom 0.813: R3.12.1 R3.12.2 R3.12.3 R3.12.4 R3.12.5
N$58
  Bottom 0.813: R4.12.1 R4.12.2 R4.12.3 R4.12.4 R4.12.5
N$59
  Bottom 0.813: R3.13.1 R3.13.2 R3.13.3 R3.13.4 R3.13.5
N$60
  Bottom 0.813: R4.13.1 R4.13.2 R4.13.3 R4.13.4 R4.13.5
N$61
  Bottom 0.813: R3.14.1 R3.14.2 R3.14.3 R3.14.4 R3.14.5
N$62
  Bottom 0.813: R4.14.1 R4.14.2 R4.14.3 R4.14.4 R4.14.5
N$63
  Bottom 0.813: R3.15.1 R3.15.2 R3.15.3 R3.15.4 R3.15.5
N$64
  Bottom 0.813: R4.15.1 R4.15.2 R4.15.3 R4.15.4 R4.15.5
N$65
  Bottom 0.813: R3.16.1 R3.16.2 R3.16.3 R3.16.4 R3.16.5
N$66
  Bottom 0.813: R4.16.1 R4.16.2 R4.16.3 R4.16.4 R4.16.5
SLEEVE
  Bottom 0.813: U$4.P$3 94.69,36.12 CON-1.3
SWITCH
  Bottom 0.813: CON-1.2 90.17,34.93 U$4.P$2
TOP-1
  Bottom 0.813: TOP-1.1 TOP-1.3 TOP-1.5 TOP-1.7 TOP-1.9 TOP-1.11 TOP-1.13 TOP-1.15 TOP-1.17 TOP-1.19 TOP-1.21 TOP-1.23 TOP-1.25 TOP-1.27 TOP-1.29 TOP-1.31 TOP-2.2 TOP-3.1 TOP-3.3 TOP-3.5 TOP-3.7 TOP-3.9 TOP-3.11 TOP-3.13 TOP-3.15 TOP-3.17 TOP-3.19 TOP-3.21 TOP-3.23 TOP-3.25 TOP-3.27 | SJ9.1 TOP-3.27 | TOP-3.27 TOP-3.29 TOP-3.31
TOP-2
  Bottom 0.813: TOP-1.2 TOP-1.4 TOP-1.6 TOP-1.8 TOP-1.10 TOP-1.12 TOP-1.14 TOP-1.16 TOP-1.18 TOP-1.20 TOP-1.22 TOP-1.24 TOP-1.26 TOP-1.28 TOP-1.30 TOP-1.32 TOP-2.1 TOP-3.2 TOP-3.4 TOP-3.6 TOP-3.8 TOP-3.10 TOP-3.12 TOP-3.14 TOP-3.16 TOP-3.18 TOP-3.20 TOP-3.22 TOP-3.24 TOP-3.26 TOP-3.28 TOP-3.30 TOP-3.32 91.12,45.72 91.44,45.4 91.76,45.09 91.76,41.91 91.44,41.59 91.44,40.77 SJ3.1
USB-D+
  Top 0.406: U$3.D+ 87.95,17.78 87.63,17.46 87.63,12.38 88.27,11.75 89.85,11.75 90.17,11.43 CON1.2
USB-DI
  Top 0.406: CON1.3 92.71,10.79 93.03,11.11 93.03,14.29 92.08,15.24 92.08,16.51 91.61,16.98 U$3.D-
USB-GND
  Top 0.406: U$3.GND 87.33,19.38 86.68,18.73 86.68,12.06 87.63,11.11 CON1.1
USB-V+  (via drill 0.51)
  Top 0.406: U$3.VUSB 90.16,16.18 90.17,16.19 90.17,15.56 v90.17,15.24
  Bottom 0.406: CON1.4 95.25,11.43 94.62,12.06 90.49,12.06 90.17,12.38 v90.17,15.24

### Text on the board
tPlace: - | - | + | + | 1 | 2 | 3 | 4 | 5 | 6 | 7 | 8 | 9 | 10 | 11 | 12 | 13 | 14 | 14 | 15 | 16 | 17 | 18 | 19 | 20 | 21 | 22 | 23 | 24 | 25 | 26 | 27 | 28 | 29 | 30 | 31 | 32 | + | S | - | justgeek.de | J | I | H | G | F | - | + | E | D | C | B | A | 1 | 2 | 3 | 4 | 5 | 6 | 7 | 8 | 9 | 10 | 11 | 12 | 13 | 14 | 14 | 15 | 16 | 17 | 18 | 19 | 20 | 21 | 22 | 23 | 24 | 25 | 26 | 27 | 28 | 29 | 30 | 31 | 32 | - | D+ | D- | + | - | - | + | +
bPlace: - | - | + | + | 1 | 2 | 3 | 4 | 5 | 6 | 7 | 8 | 9 | 10 | 11 | 12 | 13 | 14 | 14 | 15 | 16 | 17 | 18 | 19 | 20 | 21 | 22 | 23 | 24 | 25 | 26 | 27 | 28 | 29 | 30 | 31 | 32 | + | S | J | - | I | H | G | F | - | + | E | D | C | B | - | D+ | D- | + | A | 1 | 2 | 3 | 4 | 5 | 6 | 7 | 8 | 9 | 10 | 11 | 12 | 13 | 14 | 14 | 15 | 16 | 17 | 18 | 19 | 20 | 21 | 22 | 23 | 24 | 25 | 26 | 27 | 28 | 29 | 30 | 31 | 32 | - | - | + | +